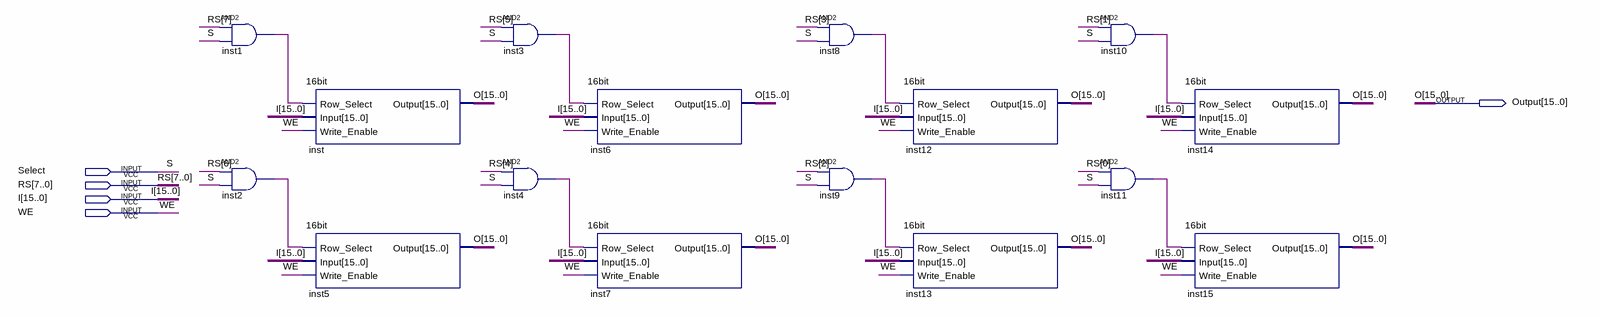
[diagram p0: schematic sheet]
// Quartus schematic dword.bdf as structural Verilog: 16 symbols, 5 pins
module dword (
  input  Select,
  input  [7:0] RS,
  input  [15:0] I,
  input  WE,
  output [15:0] Output
);

  wire inst1_out, inst2_out, inst3_out, inst4_out, inst8_out, inst9_out, inst10_out, inst11_out;

  and inst1 (inst1_out, RS[7], Select);
  and inst2 (inst2_out, RS[6], Select);
  \16bit  inst (.Row_Select(inst1_out), .Input(I), .Write_Enable(WE), .Output(Output));
  \16bit  inst5 (.Row_Select(inst2_out), .Input(I), .Write_Enable(WE), .Output(Output));
  and inst3 (inst3_out, RS[5], Select);
  and inst4 (inst4_out, RS[4], Select);
  \16bit  inst6 (.Row_Select(inst3_out), .Input(I), .Write_Enable(WE), .Output(Output));
  \16bit  inst7 (.Row_Select(inst4_out), .Input(I), .Write_Enable(WE), .Output(Output));
  and inst8 (inst8_out, RS[3], Select);
  and inst9 (inst9_out, RS[2], Select);
  \16bit  inst12 (.Row_Select(inst8_out), .Input(I), .Write_Enable(WE), .Output(Output));
  \16bit  inst13 (.Row_Select(inst9_out), .Input(I), .Write_Enable(WE), .Output(Output));
  and inst10 (inst10_out, RS[1], Select);
  and inst11 (inst11_out, RS[0], Select);
  \16bit  inst14 (.Row_Select(inst10_out), .Input(I), .Write_Enable(WE), .Output(Output));
  \16bit  inst15 (.Row_Select(inst11_out), .Input(I), .Write_Enable(WE), .Output(Output));

  // Other names for the same wires on the sheet: O[15:0] = Output; S = Select
endmodule
